# EAGLE design Schematic_v1 (EAGLE 9.6.2)
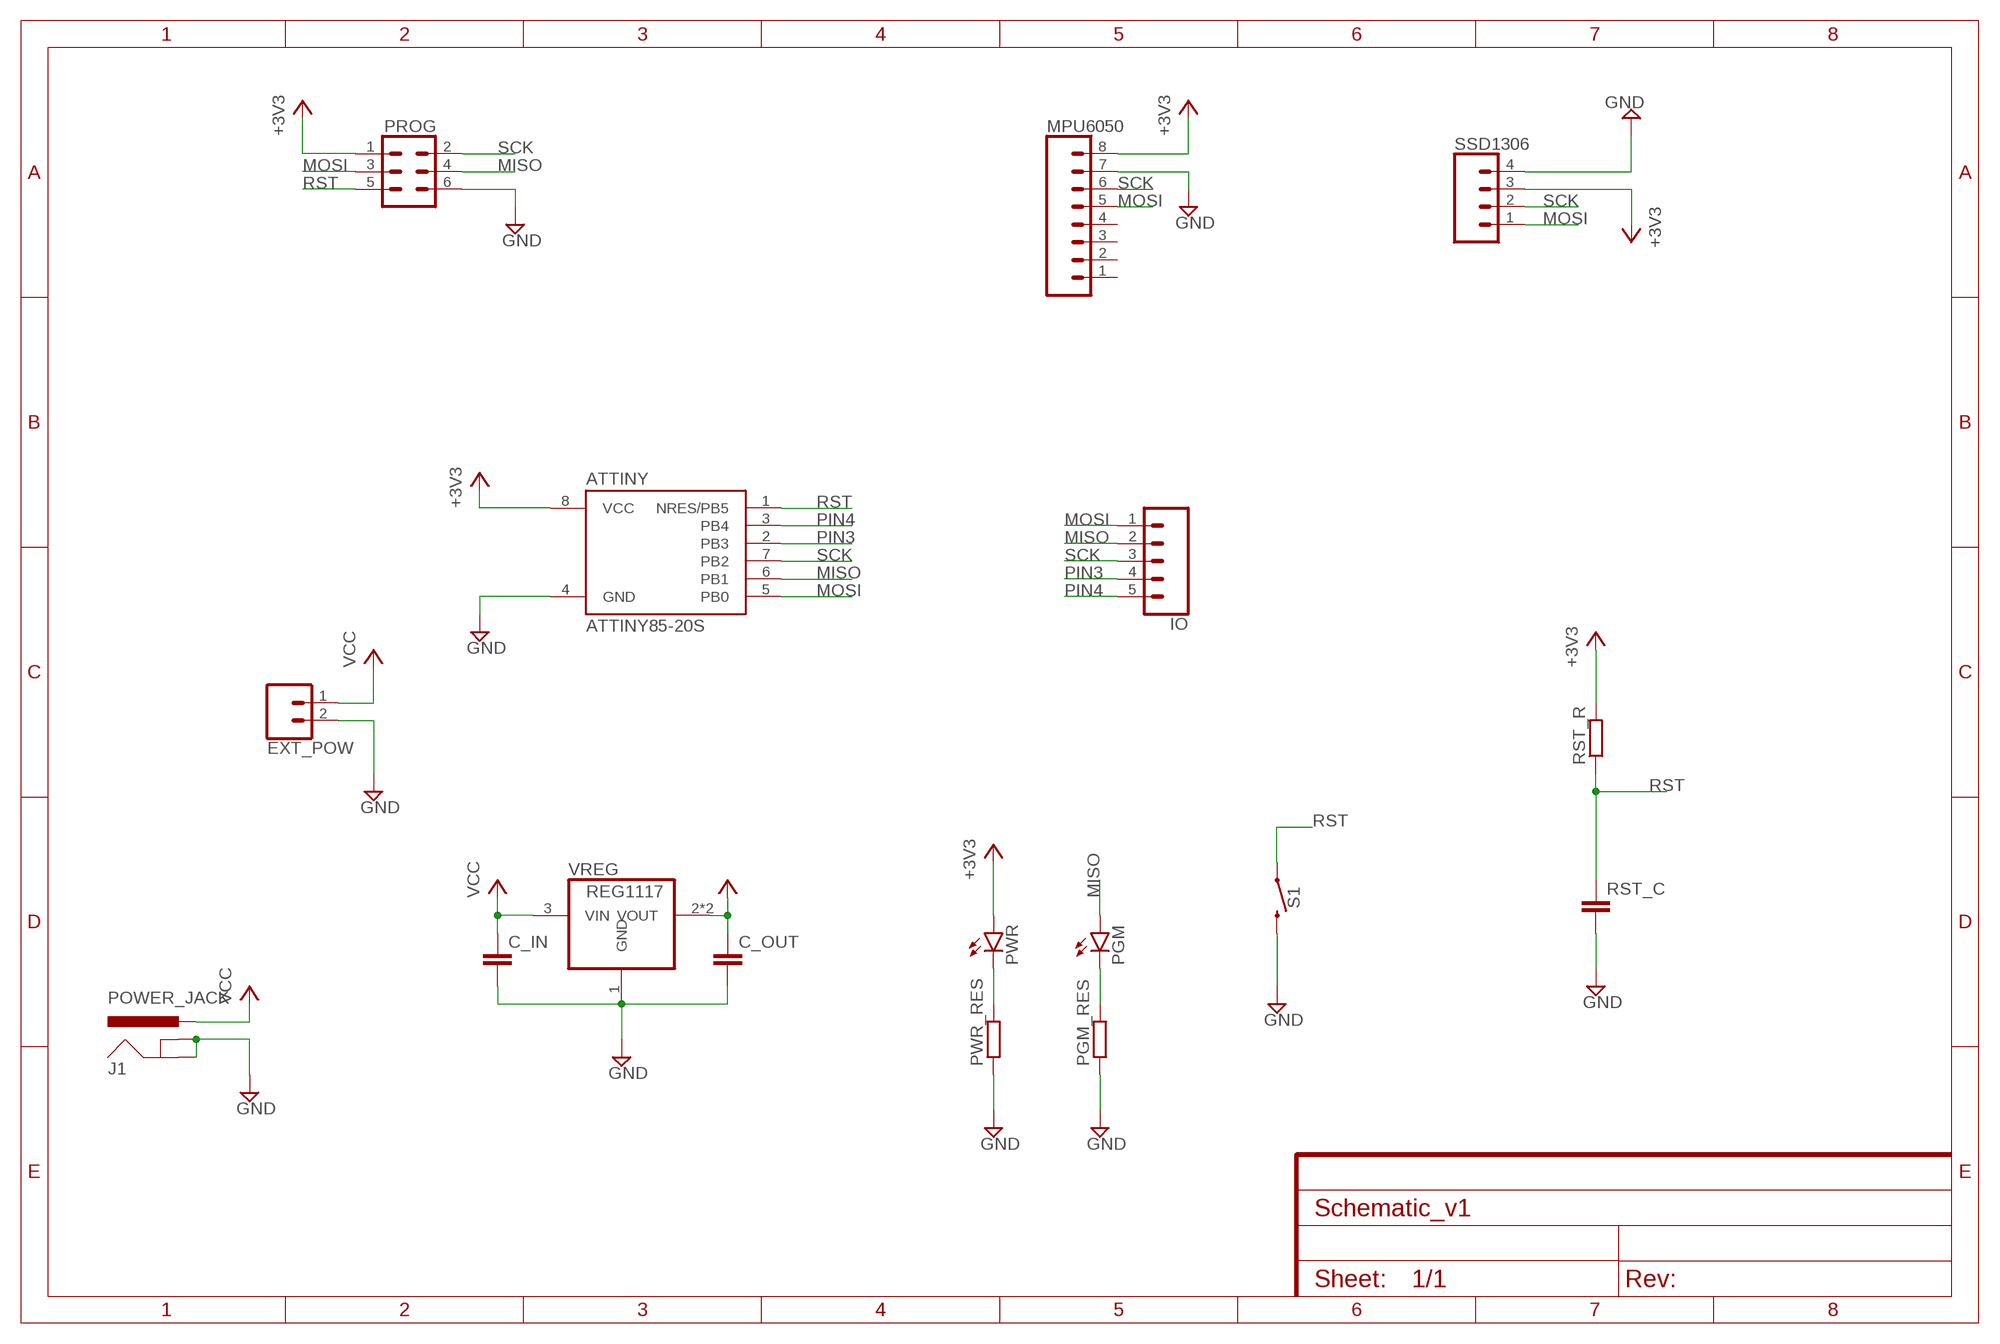
[diagram p0: schematic, sheet 1]

## Parts
ATTINY  ATTINY85-20S  [SOIC8_EIAJ_208MIL]
C_IN  C-EUC1206  [C1206]
C_OUT  C-EUC1206  [C1206]
EXT_POW  CONN_021X02_NO_SILK  [1X02_NO_SILK]
IO  CONN_05  [1X05]
J1  POWER_JACK  [POWER_JACK_PTH]
MPU6050  CONN_08"  [1X08]
PGM  LEDSML1206  [SML1206]
PGM_RES  R-EU_R1206  [R1206]
PROG  CONN_03X2NO_SILK  [2X3-NS]
PWR  LEDSML1206  [SML1206]
PWR_RES  R-EU_R1206  [R1206]
RST_C  C-EUC1206  [C1206]
RST_R  R-EU_R1206  [R1206]
S1  MOMENTARY-SWITCH-SPST-PTH-6.0MM  [TACTILE_SWITCH_PTH_6.0MM]
SSD1306  CONN_04  [1X04]
VREG  REG1117  [SOT223]

## Nets
+3V3: ATTINY.8(VCC) C_OUT.1 MPU6050.8 PROG.1 PWR.A RST_R.2 SSD1306.3 VREG.2(VOUT) VREG.4(VOUT)
GND: ATTINY.4(GND) C_IN.2 C_OUT.2 EXT_POW.2 J1.GND J1.GNDBREAK MPU6050.7 PGM_RES.1 PROG.6 PWR_RES.1 RST_C.2 S1.3 SSD1306.4 VREG.1(GND)
MISO: ATTINY.6(PB1) IO.2 PGM.A PROG.4
MOSI: ATTINY.5(PB0) IO.1 MPU6050.5 PROG.3 SSD1306.1
N$1: PWR.C PWR_RES.2
N$3: PGM.C PGM_RES.2
PIN3: ATTINY.2(PB3) IO.4
PIN4: ATTINY.3(PB4) IO.5
RST: ATTINY.1(NRES/PB5) PROG.5 RST_C.1 RST_R.1 S1.1
SCK: ATTINY.7(PB2) IO.3 MPU6050.6 PROG.2 SSD1306.2
VCC: C_IN.1 EXT_POW.1 J1.PWR VREG.3(VIN)
Unconnected: MPU6050.1 MPU6050.2 MPU6050.3 MPU6050.4

## Library data of the parts
ATTINY = _hhn_attiny25_45_85:ATTINY85*: ATMEL ATtiny 85 Packages: P = PDIP 08 30mil S = SOIC 08 EIAJ 208mil Technologies Note: for complete ordering code (temp. range, finish, tape&reel etc.) see www.atmel.com • Supply Voltage: V = (1.8…5.5)V | [blank] = (2.7…5.5)V • Speed: 10 = 10 MHz | 20 = 20 MHz Author: Dipl.-Ing. FH Rainer Bayer HHN Hochschule Heilbronn (Heilbronn University), rainer.bayer@hs-heilbronn.de Ingenieurbüro ing-rb, mail@ing-rb.de
C_IN C_OUT RST_C = rcl:C-EU: CAPACITOR, European symbol; SPICEPREFIX: C
EXT_POW = SparkFun-Connectors:CONN_02: Multi connection point. Often used as Generic Header-pin footprint for 0.1 inch spaced/style header connections On any of the 0.1 inch spaced packages, you can populate with these: Break Away Headers - Straight <https://www.sparkfun.com/products/116> (PRT-00116) Break Away Male Headers - Right Angle <https://www.sparkfun.com/products/553> (PRT-00553) Female Headers <https://www.sparkfun.com/products/115> (PRT-00115) Break Away Headers - Machine Pin <https://www.sparkfun.com/products/117> (PRT-00117) Break Away Female Headers - Swiss Machine Pin <https://www.sparkfun.com/products/743> (PRT-00743) For SCREWTERMINALS and SPRING TERMINALS visit here: Screw Terimnals on SparkFun.com <https://www.sparkfun.com/search/results?term=Screw+Terminals> (5mm/3.5mm/2.54mm spacing) This device is also useful as a general connection point to wire up your design to another part of your project. Our various solder wires solder well into these plated through hole pads. Hook-Up Wire - Assortment (Stranded, 22 AWG) <https://www.sparkfun.com/products/11375> (PRT-11375) Hook-Up Wire - Assortment (Solid Core, 22 AWG) <https://www.sparkfun.com/products/11367> (PRT-11367) View the entire wire category on our website here <https://www.sparkfun.com/categories/141> Special notes: Molex polarized connector foot print use with: PRT-08233 with associated crimp pins and housings. 2.54_SCREWTERM for use with PRT-10571. 3.5mm Screw Terminal footprints for PRT-08084 5mm Screw Terminal footprints for use with PRT-08432
IO = SparkFun-Connectors:CONN_05: Multi connection point. Often used as Generic Header-pin footprint for 0.1 inch spaced/style header connections On any of the 0.1 inch spaced packages, you can populate with these: Break Away Headers - Straight <https://www.sparkfun.com/products/116> (PRT-00116) Break Away Male Headers - Right Angle <https://www.sparkfun.com/products/553> (PRT-00553) Female Headers <https://www.sparkfun.com/products/115> (PRT-00115) Break Away Headers - Machine Pin <https://www.sparkfun.com/products/117> (PRT-00117) Break Away Female Headers - Swiss Machine Pin <https://www.sparkfun.com/products/743> (PRT-00743) For SCREWTERMINALS and SPRING TERMINALS visit here: Screw Terimnals on SparkFun.com <https://www.sparkfun.com/search/results?term=Screw+Terminals> (5mm/3.5mm/2.54mm spacing) This device is also useful as a general connection point to wire up your design to another part of your project. Our various solder wires solder well into these plated through hole pads. Hook-Up Wire - Assortment (Stranded, 22 AWG) <https://www.sparkfun.com/products/11375> (PRT-11375) Hook-Up Wire - Assortment (Solid Core, 22 AWG) <https://www.sparkfun.com/products/11367> (PRT-11367) View the entire wire category on our website here <https://www.sparkfun.com/categories/141> Special notes: Molex polarized connector foot print use with SKU : PRT-08231 with associated crimp pins and housings. 1MM SMD Version SKU: PRT-10208
J1 = SparkFun-Connectors:POWER_JACK: Power Jack Connector This is the standard 5.5mm barrel jack for power. The PTH is the most common, proven, reliable, footprint. The Slot footprint only works if the mill layer is transmitted to the PCB fab house so be warned. Here are the connectors we sell at SparkFun: DC Barrel Power Jack/Connector <https://www.sparkfun.com/products/119> (PRT-00119) DC Barrel Power Jack/Connector (SMD) <https://www.sparkfun.com/products/12748> (PRT-12748) DC Barrel Jack Adapter - Breadboard Compatible <https://www.sparkfun.com/products/10811> (PRT-10811) It is used on this SparkFun product (and many, many others): SparkFun RedBoard - Programmed with Arduino <https://www.sparkfun.com/products/12757> (DEV-12757) Also, if you need a mating power supply or connector, please check these out: Wall Adapter Power Supply - 9VDC 650mA <https://www.sparkfun.com/products/298> (TOL-00298) DC Barrel Jack Adapter - Male <https://www.sparkfun.com/products/10287> (PRT-10287); PROD_ID: CONN-08197
MPU6050 = SparkFun-Connectors:CONN_08: Multi connection point. Often used as Generic Header-pin footprint for 0.1 inch spaced/style header connections On any of the 0.1 inch spaced packages, you can populate with these: Break Away Headers - Straight <https://www.sparkfun.com/products/116> (PRT-00116) Break Away Male Headers - Right Angle <https://www.sparkfun.com/products/553> (PRT-00553) Female Headers <https://www.sparkfun.com/products/115> (PRT-00115) Break Away Headers - Machine Pin <https://www.sparkfun.com/products/117> (PRT-00117) Break Away Female Headers - Swiss Machine Pin <https://www.sparkfun.com/products/743> (PRT-00743) Arduino Stackable Header - 8 Pin <https://www.sparkfun.com/products/9279> (PRT-09279) For SCREWTERMINALS and SPRING TERMINALS visit here: Screw Terimnals on SparkFun.com <https://www.sparkfun.com/search/results?term=Screw+Terminals> (5mm/3.5mm/2.54mm spacing) This device is also useful as a general connection point to wire up your design to another part of your project. Our various solder wires solder well into these plated through hole pads. Hook-Up Wire - Assortment (Stranded, 22 AWG) <https://www.sparkfun.com/products/11375> (PRT-11375) Hook-Up Wire - Assortment (Solid Core, 22 AWG) <https://www.sparkfun.com/products/11367> (PRT-11367) View the entire wire category on our website here <https://www.sparkfun.com/categories/141> Special notes: Molex polarized connector foot print use with SKU : PRT-08231 with associated crimp pins and housings. 1MM SMD Version SKU: PRT-10208 NOTES ON THE VARIANTS LOCK and LOCK_LONGPADS... This footprint was designed to help hold the alignment of a through-hole component (i.e. 6-pin header) while soldering it into place. You may notice that each hole has been shifted either up or down by 0.005 of an inch from it's more standard position (which is a perfectly straight line). This slight alteration caused the pins (the squares in the middle) to touch the edges of the holes. Because they are alternating, it causes a "brace" to hold the component in place. 0.005 has proven to be the perfect amount of "off-center" position when using our standard breakaway headers. Although looks a little odd when you look at the bare footprint, once you have a header in there, the alteration is very hard to notice. Also,if you push a header all the way into place, it is covered up entirely on the bottom side.; PROD_ID: CONN-08438
PGM PWR = led:LED: LED OSRAM: - CHIPLED LG R971, LG N971, LY N971, LG Q971, LY Q971, LO R971, LY R971 LH N974, LH R974 LS Q976, LO Q976, LY Q976 LO Q996 - Hyper CHIPLED LW Q18S LB Q993, LB Q99A, LB R99A - SideLED LS A670, LO A670, LY A670, LG A670, LP A670 LB A673, LV A673, LT A673, LW A673 LH A674 LY A675 LS A676, LA A676, LO A676, LY A676, LW A676 LS A679, LY A679, LG A679 - Hyper Micro SIDELED® LS Y876, LA Y876, LO Y876, LY Y876 LT Y87S - SmartLED LW L88C, LW L88S LB L89C, LB L89S, LG L890 LS L89K, LO L89K, LY L89K LS L896, LA L896, LO L896, LY L896 - TOPLED LS T670, LO T670, LY T670, LG T670, LP T670 LSG T670, LSP T670, LSY T670, LOP T670, LYG T670 LG T671, LOG T671, LSG T671 LB T673, LV T673, LT T673, LW T673 LH T674 LS T676, LA T676, LO T676, LY T676, LB T676, LH T676, LSB T676, LW T676 LB T67C, LV T67C, LT T67C, LS T67K, LO T67K, LY T67K, LW E67C LS E67B, LA E67B, LO E67B, LY E67B, LB E67C, LV E67C, LT E67C LW T67C LS T679, LY T679, LG T679 LS T770, LO T770, LY T770, LG T770, LP T770 LB T773, LV T773, LT T773, LW T773 LH T774 LS E675, LA E675, LY E675, LS T675 LS T776, LA T776, LO T776, LY T776, LB T776 LHGB T686 LT T68C, LB T68C - Hyper Mini TOPLED® LB M676 - Mini TOPLED Santana® LG M470 LS M47K, LO M47K, LY M47K Source: http://www.osram.convergy.de LUXEON: - LUMILED® LXK2-PW12-R00, LXK2-PW12-S00, LXK2-PW14-U00, LXK2-PW14-V00 LXK2-PM12-R00, LXK2-PM12-S00, LXK2-PM14-U00 LXK2-PE12-Q00, LXK2-PE12-R00, LXK2-PE12-S00, LXK2-PE14-T00, LXK2-PE14-U00 LXK2-PB12-K00, LXK2-PB12-L00, LXK2-PB12-M00, LXK2-PB14-N00, LXK2-PB14-P00, LXK2-PB14-Q00 LXK2-PR12-L00, LXK2-PR12-M00, LXK2-PR14-Q00, LXK2-PR14-R00 LXK2-PD12-Q00, LXK2-PD12-R00, LXK2-PD12-S00 LXK2-PH12-R00, LXK2-PH12-S00 LXK2-PL12-P00, LXK2-PL12-Q00, LXK2-PL12-R00 Source: www.luxeon.com KINGBRIGHT: KA-3528ASYC Source: www.kingbright.com
PGM_RES PWR_RES RST_R = rcl:R-EU_: RESISTOR, European symbol; SPICEPREFIX: R
PROG = SparkFun-Connectors:CONN_03X2: Multi connection point. Often used as Generic Header-pin footprint for 0.1 inch spaced/style header connections You can populate with any combo of single row headers, but if you'd like an exact match, check these: Header - 2x3 (Male, 0.1") <https://www.sparkfun.com/products/12807> (PRT-12807) Header - 2x3 (Female, 0.1") <https://www.sparkfun.com/products/13010> (PRT-13010) 2x3 Pin Shrouded Header <https://www.sparkfun.com/products/10877> (PRT-10877) On any of the 0.1 inch spaced packages, you can populate with these: Break Away Headers - Straight <https://www.sparkfun.com/products/116> (PRT-00116) Break Away Male Headers - Right Angle <https://www.sparkfun.com/products/553> (PRT-00553) Female Headers <https://www.sparkfun.com/products/115> (PRT-00115) Break Away Headers - Machine Pin <https://www.sparkfun.com/products/117> (PRT-00117) Break Away Female Headers - Swiss Machine Pin <https://www.sparkfun.com/products/743> (PRT-00743) Special note: the shrouded connector mates well with our 3x2 ribbon cables: Ribbon Crimp Connector - 6-pin (2x3, Female) <https://www.sparkfun.com/products/10651> (PRT-10651) Ribbon Cable - 6 wire (15ft) <https://www.sparkfun.com/products/10646> (PRT-10646)
S1 = SparkFun-Switches:MOMENTARY-SWITCH-SPST: Momentary Switch (Pushbutton) - SPST Normally-open (NO) SPST momentary switches (buttons, pushbuttons). Variants PTH-12MM - 12mm square, through-hole Momentary Pushbutton Switch - 12mm Square <https://www.sparkfun.com/products/9190> (COM-09190) PTH-6.0MM, PTH-6.0MM-KIT - 6.0mm square, through-hole Mini Pushbutton Switch <https://www.sparkfun.com/products/97> (COM-00097) KIT package intended for soldering kit's - only one side of pads' copper is exposed. PTH-RIGHT-ANGLE-KIT - Right-angle, through-hole Right Angle Tactile Button <https://www.sparkfun.com/products/10791> - Used on SparkFun BigTime Watch Kit <https://www.sparkfun.com/products/11734> SMD-12MM - 12mm square, surface-mount Tactile Button - SMD (12mm) <https://www.sparkfun.com/products/12993> (COM-12993) Used on SparkFun PicoBoard <https://www.sparkfun.com/products/11888> SMD-4.5MM - 4.5mm Square Trackball Switch Used on SparkFun Blackberry Trackballer Breakout <https://www.sparkfun.com/products/13169> SMD-4.6MMX2.8MM - 4.60mm x 2.80mm, surface mount Used on SparkFun SAMD21 Mini Breakout <https://www.sparkfun.com/products/13664> SMD-5.2MM, SMD-5.2-REDUNDANT - 5.2mm square, surface-mount Mini Pushbutton Switch - SMD <https://www.sparkfun.com/products/8720> (COM-08720) Used on Arduino Pro Mini <https://www.sparkfun.com/products/11114> REDUNDANT package connects both switch circuits together SMD-6.0X3.5MM - 6.0 x 3.5mm, surface mount Momentary Reset Switch SMD <https://www.sparkfun.com/products/8229> (COM-08229) SMD-6.2MM-TALL - 6.2mm square, surface mount Tactile Button - SMD (6mm) <https://www.sparkfun.com/products/12992> Used on SparkFun Digital Sandbox <https://www.sparkfun.com/products/12651> SMD-RIGHT-ANGLE - Right-angle, surface mount Used on SparkFun Block for Intel® Edison - Arduino <https://www.sparkfun.com/products/13036>; PROD_ID: SWCH-08441; SF_SKU: COM-00097
SSD1306 = SparkFun-Connectors:CONN_04: Multi connection point. Often used as Generic Header-pin footprint for 0.1 inch spaced/style header connections On any of the 0.1 inch spaced packages, you can populate with these: Break Away Headers - Straight <https://www.sparkfun.com/products/116> (PRT-00116) Break Away Male Headers - Right Angle <https://www.sparkfun.com/products/553> (PRT-00553) Female Headers <https://www.sparkfun.com/products/115> (PRT-00115) Break Away Headers - Machine Pin <https://www.sparkfun.com/products/117> (PRT-00117) Break Away Female Headers - Swiss Machine Pin <https://www.sparkfun.com/products/743> (PRT-00743) For SCREWTERMINALS and SPRING TERMINALS visit here: Screw Terimnals on SparkFun.com <https://www.sparkfun.com/search/results?term=Screw+Terminals> (5mm/3.5mm/2.54mm spacing) This device is also useful as a general connection point to wire up your design to another part of your project. Our various solder wires solder well into these plated through hole pads. Hook-Up Wire - Assortment (Stranded, 22 AWG) <https://www.sparkfun.com/products/11375> (PRT-11375) Hook-Up Wire - Assortment (Solid Core, 22 AWG) <https://www.sparkfun.com/products/11367> (PRT-11367) View the entire wire category on our website here <https://www.sparkfun.com/categories/141> Special notes: Molex polarized connector foot print use with SKU : PRT-08231 with associated crimp pins and housings. 1MM SMD Version SKU: PRT-10208; PROD_ID: CONN-09696
VREG = burr-brown-mod:REG1117: 800mA and 1A Low Dropout (LDO) Positive Regulator 1.8V, 2.5V, 2.85V, 3.3V, 5V, and Adj; MPN: REG1117; OC_FARNELL: 1097566; OC_NEWARK: 14P6981

## Board
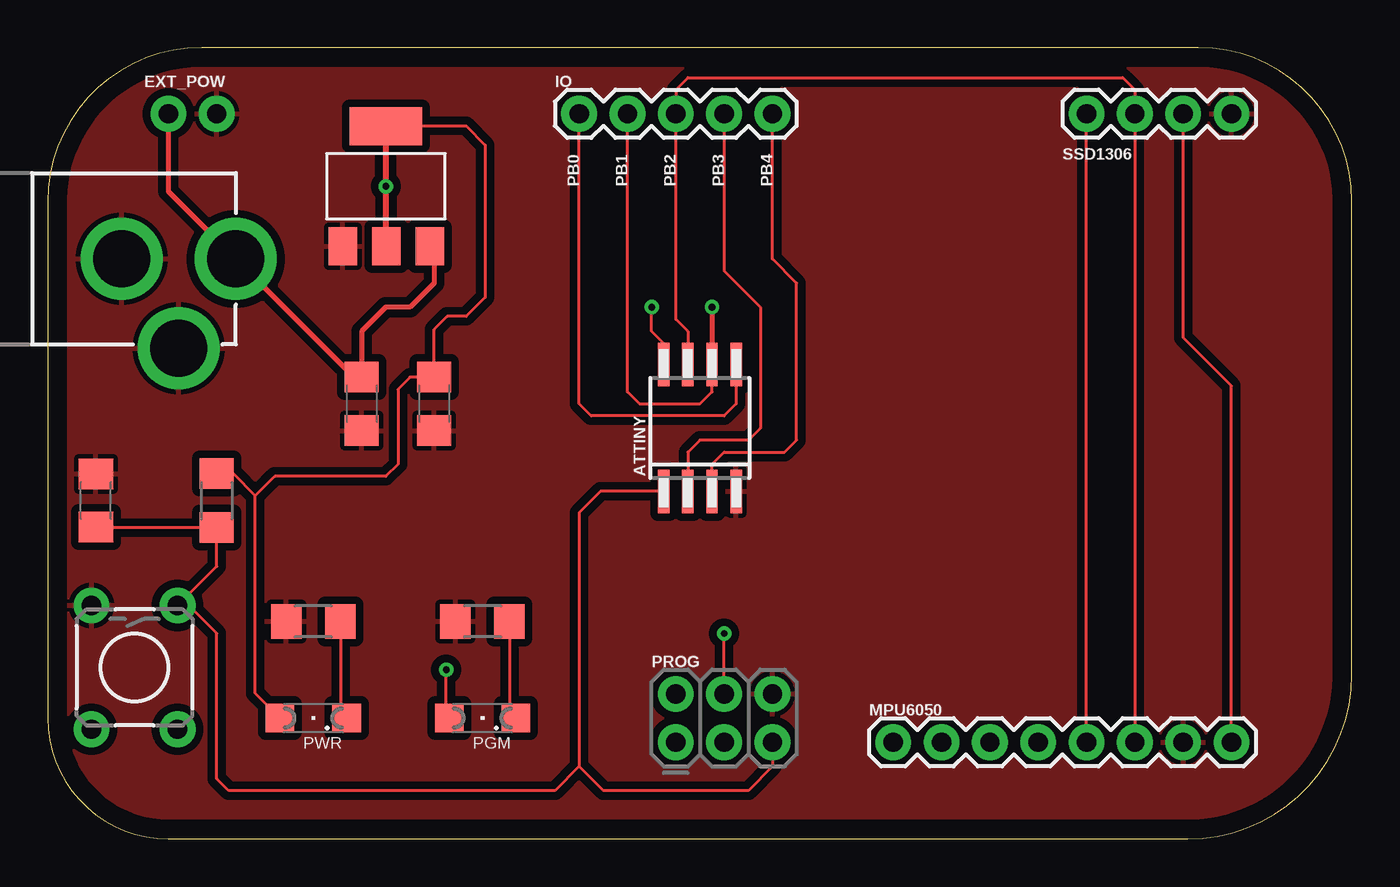
[diagram p1: board, top side]
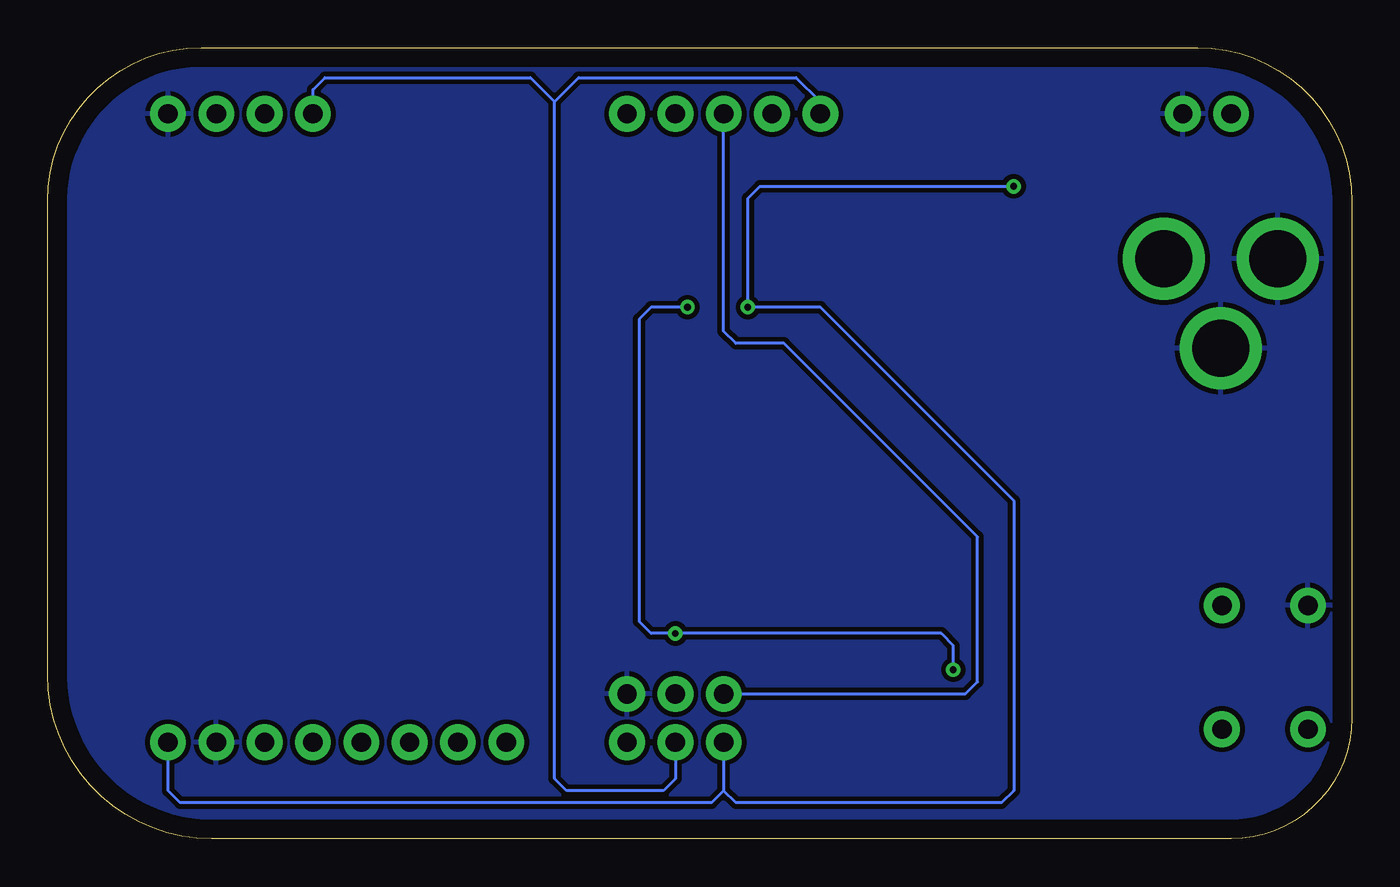
[diagram p2: board, bottom side, seen from below]

Size 68.56 x 41.58 mm. Coordinates in mm from the lower left corner, seen from the top.
Outline: 6.35,0 59.92,0 arc90 68.56,8.64 68.56,33.51 arc90 60.49,41.58 8.1,41.58 arc90 0,33.48 0,6.35 arc90 6.35,0
Copper layers (1*16): Top 0.035mm / dielectric 1.5mm / Bottom 0.035mm
Design rules "default": minimum track width 6mil, minimum drill 0.35mm, track to track 6mil, track to pad 6mil, pad to pad 6mil, via to via 6mil, smd to smd 6mil, copper to edge 40mil, drill to drill 6mil, minimum pad ring 10mil, minimum via ring 8mil, stop-mask expansion 4mil, vias tented up to drill 0mil, thermal gap 10mil

### Footprints (pad centres in the part's own frame; a part is rotated, then mirrored left to right if it is on the bottom)
SOIC8_EIAJ_208MIL = smd 0.6 x 2.286: 1 -1.905,-3.33; 2 -0.635,-3.33; 3 0.635,-3.33; 4 1.905,-3.33; 5 1.905,3.33; 6 0.635,3.33; 7 -0.635,3.33; 8 -1.905,3.33
C1206 = smd 1.6 x 1.8: 1 -1.4,0; 2 1.4,0
1X02_NO_SILK = drill 1.016 pad 1.88: 1 0,0; 2 2.54,0
1X05 = drill 1.016 pad 1.88: 1 0,0; 2 2.54,0; 3 5.08,0; 4 7.62,0; 5 10.16,0
POWER_JACK_PTH = drill 2.997 pad 4.318: GND 0,7.7; GNDBREAK 4.7,10.7; PWR 0,13.7
1X08 = drill 1.016 pad 1.88: 1 0,0; 2 2.54,0; 3 5.08,0; 4 7.62,0; 5 10.16,0; 6 12.7,0; 7 15.24,0; 8 17.78,0
SML1206 = smd 1.5 x 1.5: A 1.75,0; C -1.75,0
R1206 = smd 1.6 x 1.803: 1 -1.422,0; 2 1.422,0
2X3-NS = drill 1.016 pad 1.88: 1 -2.54,-1.27; 2 -2.54,1.27; 3 0,-1.27; 4 0,1.27; 5 2.54,-1.27; 6 2.54,1.27
TACTILE_SWITCH_PTH_6.0MM = drill 1.016 pad 1.88: 1 -3.251,2.261; 2 3.251,2.261; 3 -3.251,-2.261; 4 3.251,-2.261
1X04 = drill 1.016 pad 1.88: 1 0,0; 2 2.54,0; 3 5.08,0; 4 7.62,0
SOT223 = smd 1.499 x 2.007: 1 -2.261,-3.15; 2 0.025,-3.15; 3 2.311,-3.15 | smd 3.81 x 2.007: 4 0,3.15

### Placement (x,y rotation side)
ATTINY  34.29,21.59 0 top
C_IN  16.51,22.86 270 top
C_OUT  20.32,22.86 270 top
EXT_POW  6.35,38.1 0 top
IO  27.94,38.1 0 top
J1  -3.81,30.48 270 top
MPU6050  44.45,5.08 0 top
PGM  22.86,6.35 180 top
PGM_RES  22.86,11.43 0 top
PROG  35.56,6.35 0 top
PWR  13.97,6.35 180 top
PWR_RES  13.97,11.43 0 top
RST_C  2.54,17.78 90 top
RST_R  8.89,17.78 90 top
S1  4.57,9.02 270 top
SSD1306  54.61,38.1 0 top
VREG  17.78,34.29 0 top

### Tracks (layer width: path | path; a pad name or v marks a point on that pad's centre or on a via)
+3V3  (via drill 0.35)
  Top 0.152: C_OUT.1 20.32,26.78 21,27.46 22,27.46 23,28.46 23,36.46 22,37.46 17.8,37.46 VREG.4 | 20.98,24.92 C_OUT.1 | C_OUT.1 19.05,24.26 18.41,23.62 18.41,19.69 17.78,19.05 11.94,19.05 10.92,18.03 | PWR.A 10.92,7.65 10.92,18.03 | RST_R.2 9.75,19.2 10.92,18.03 | ATTINY.8 32.38,26.04 31.75,26.67 v31.75,27.94 | MPU6050.8 62.23,23.8 59.7,26.33 SSD1306.3
  Top 0.254: 17.8,34.27 v17.78,34.29
  Top 0.305: VREG.2 17.8,34.27 | VREG.4 v17.78,34.29
  Bottom 0.152: v17.78,34.29 31.11,34.29 31.75,33.66 v31.75,27.94 27.94,27.94 17.78,17.78 17.78,2.54 18.41,1.91 32.38,1.91 33.02,2.54 | PROG.1 33.02,2.54 | 33.02,2.54 33.66,1.91 61.59,1.91 62.23,2.54 MPU6050.8
GND
  pour Top (isolate 0.406): 13.97,41.91 59.91,41.91 arc-90 68.58,33.24 68.58,7.62 arc-90 60.96,0 12.7,0 6.35,0 arc-90 0,6.35 0,33.24 arc-90 8.67,41.91
  pour Bottom (isolate 0.254): 10.16,41.91 59.91,41.91 arc-90 68.58,33.24 68.58,8.19 arc-90 60.39,0 6.35,0 arc-90 0,6.35 0,12.7 0,33.72 arc-90 8.19,41.91 8.89,41.91
MISO  (via drill 0.35)
  Top 0.152: ATTINY.6 34.92,24.77 34.92,23.5 34.29,22.86 31.11,22.86 30.48,23.5 IO.2 | PROG.4 v35.56,10.8 | PGM.A 20.95,6.5 v20.95,8.89
  Top 0.254: v34.92,27.94 34.92,24.77
  Bottom 0.152: v34.92,27.94 36.83,27.94 37.47,27.3 37.47,11.43 36.83,10.8 v35.56,10.8 21.59,10.8 20.95,10.16 v20.95,8.89
MOSI
  Top 0.152: ATTINY.5 36.2,22.86 35.56,22.23 28.57,22.23 27.94,22.86 IO.1 | MPU6050.5 SSD1306.1
  Bottom 0.152: PROG.3 35.56,3.17 36.2,2.54 41.27,2.54 41.91,3.17 41.91,38.73 | 41.91,38.73 40.64,40.01 29.21,40.01 27.94,38.73 IO.1 | SSD1306.1 54.61,39.37 53.98,40.01 43.18,40.01 41.91,38.73
N$1
  Top 0.152: PWR_RES.2 15.39,6.68 PWR.C
N$3
  Top 0.152: PGM_RES.2 24.28,6.68 PGM.C
PIN3
  Top 0.152: IO.4 35.56,29.84 37.47,27.94 37.47,21.59 36.83,20.96 34.29,20.96 33.66,20.32 ATTINY.2
PIN4
  Top 0.152: ATTINY.3 34.92,19.69 35.56,20.32 38.73,20.32 39.37,20.96 39.37,29.21 38.1,30.48 IO.5
RST
  Top 0.152: RST_R.1 8.89,14.33 S1.1 7.42,12.27 8.89,10.8 8.89,3.17 9.53,2.54 26.67,2.54 27.94,3.81 | 8.87,16.38 RST_R.1 | PROG.5 38.1,3.81 36.83,2.54 29.21,2.54 27.94,3.81 | ATTINY.1 29.05,18.26 27.94,17.14 27.94,3.81 | RST_R.1 3.33,16.36 3.17,16.51 3.04,16.38 RST_C.1 2.72,16.38
SCK
  Top 0.152: ATTINY.7 33.66,26.67 33.02,27.3 IO.3 33.02,39.37 33.66,40.01 56.52,40.01 57.15,39.37 SSD1306.2 MPU6050.6
  Bottom 0.152: PROG.2 20.32,7.62 19.68,8.25 19.68,15.88 29.84,26.04 32.38,26.04 33.02,26.67 IO.3
VCC
  Top 0.254: EXT_POW.1 6.35,34.02 J1.PWR 16.11,24.26 C_IN.1 16.51,26.67 17.78,27.94 19.05,27.94 20.32,29.21 20.32,30.91 VREG.3

### Text on the board
tNames: PB0 | PB1 | PB2 | PB3 | PB4